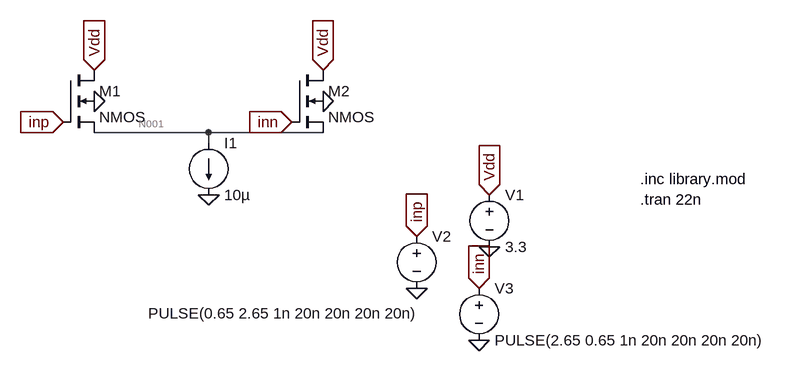
[diagram p0: schematic quiz8.asc]
quiz8.asc, the LTspice schematic file:
Version 4
SHEET 1 880 680
WIRE -400 0 -576 0
WIRE -224 0 -400 0
WIRE -400 16 -400 0
FLAG 32 96 Vdd
IOPIN 32 96 In
FLAG 32 176 0
FLAG -80 240 0
FLAG 16 320 0
FLAG -400 96 0
FLAG -576 -48 0
FLAG -224 -48 0
FLAG -224 -96 Vdd
IOPIN -224 -96 In
FLAG -576 -96 Vdd
IOPIN -576 -96 In
FLAG -624 -16 inp
IOPIN -624 -16 In
FLAG -80 160 inp
IOPIN -80 160 In
FLAG 16 240 inn
IOPIN 16 240 In
FLAG -272 -16 inn
IOPIN -272 -16 In
SYMBOL voltage 32 80 R0
WINDOW 123 0 0 Left 0
WINDOW 39 0 0 Left 0
SYMATTR InstName V1
SYMATTR Value 3.3
SYMBOL voltage 16 224 R0
WINDOW 123 0 0 Left 0
WINDOW 39 0 0 Left 0
SYMATTR InstName V3
SYMATTR Value PULSE(2.65 0.65 1n 20n 20n 20n 20n)
SYMBOL voltage -80 144 R0
WINDOW 3 -413 135 Left 2
WINDOW 123 0 0 Left 0
WINDOW 39 0 0 Left 0
SYMATTR InstName V2
SYMATTR Value PULSE(0.65 2.65 1n 20n 20n 20n 20n)
SYMBOL nmos4 -624 -96 R0
SYMATTR InstName M1
SYMATTR Value2 l=0.4u w=0.35u
SYMBOL nmos4 -272 -96 R0
SYMATTR InstName M2
SYMATTR Value2 l=0.4u w=0.35u
SYMBOL current -400 16 R0
WINDOW 123 0 0 Left 0
WINDOW 39 0 0 Left 0
SYMATTR InstName I1
SYMATTR Value 10µ
TEXT 264 72 Left 2 !.inc library.mod\n.tran 22n

The netlist it stands for:
* quiz8.asc
V1 Vdd 0 3.3
V3 inn 0 PULSE(2.65 0.65 1n 20n 20n 20n 20n)
V2 inp 0 PULSE(0.65 2.65 1n 20n 20n 20n 20n)
M1 Vdd inp N001 0 NMOS l=0.4u w=0.35u
M2 Vdd inn N001 0 NMOS l=0.4u w=0.35u
I1 N001 0 10µ
.model NMOS NMOS
.model PMOS PMOS
.lib standard.mos
.inc library.mod
.tran 22n
.backanno
.end

* Results of the author's LTspice run, read from the files saved beside the schematic
* Operating Point, zero values left out:
*   V(vdd) = 3.3 V
*   V(inn) = 2.65 V
*   V(inp) = 650 mV
*   V(n001) = 1.426 V
*   Id(M1) = 3.31 pA
*   Ib(M1) = -4.746 pA
*   Is(M1) = 1.436 pA
*   Id(M2) = 10 µA
*   Ib(M2) = -4.746 pA
*   Is(M2) = -10 µA
*   I(I1) = 10 µA
*   I(V1) = -10 µA
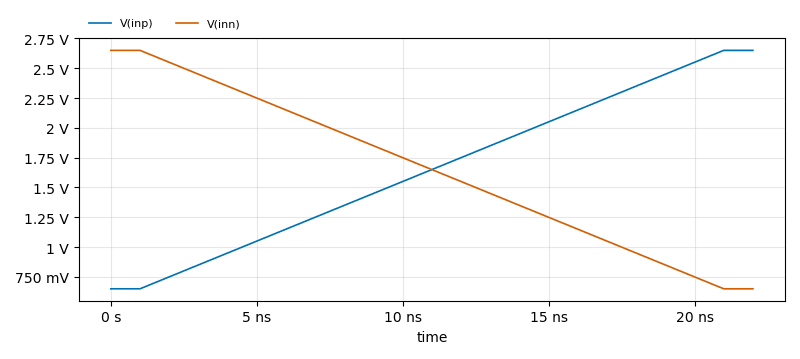
[diagram p1: Transient Analysis of quiz8.asc, plotted from the saved traces]
* Transient Analysis, 1 run:
*   V(inp): min 650 mV, max 2.65 V, average 1.65 V, rms 1.769 V, last 2.65 V
*   V(inn): min 650 mV, max 2.65 V, average 1.65 V, rms 1.769 V, last 650 mV